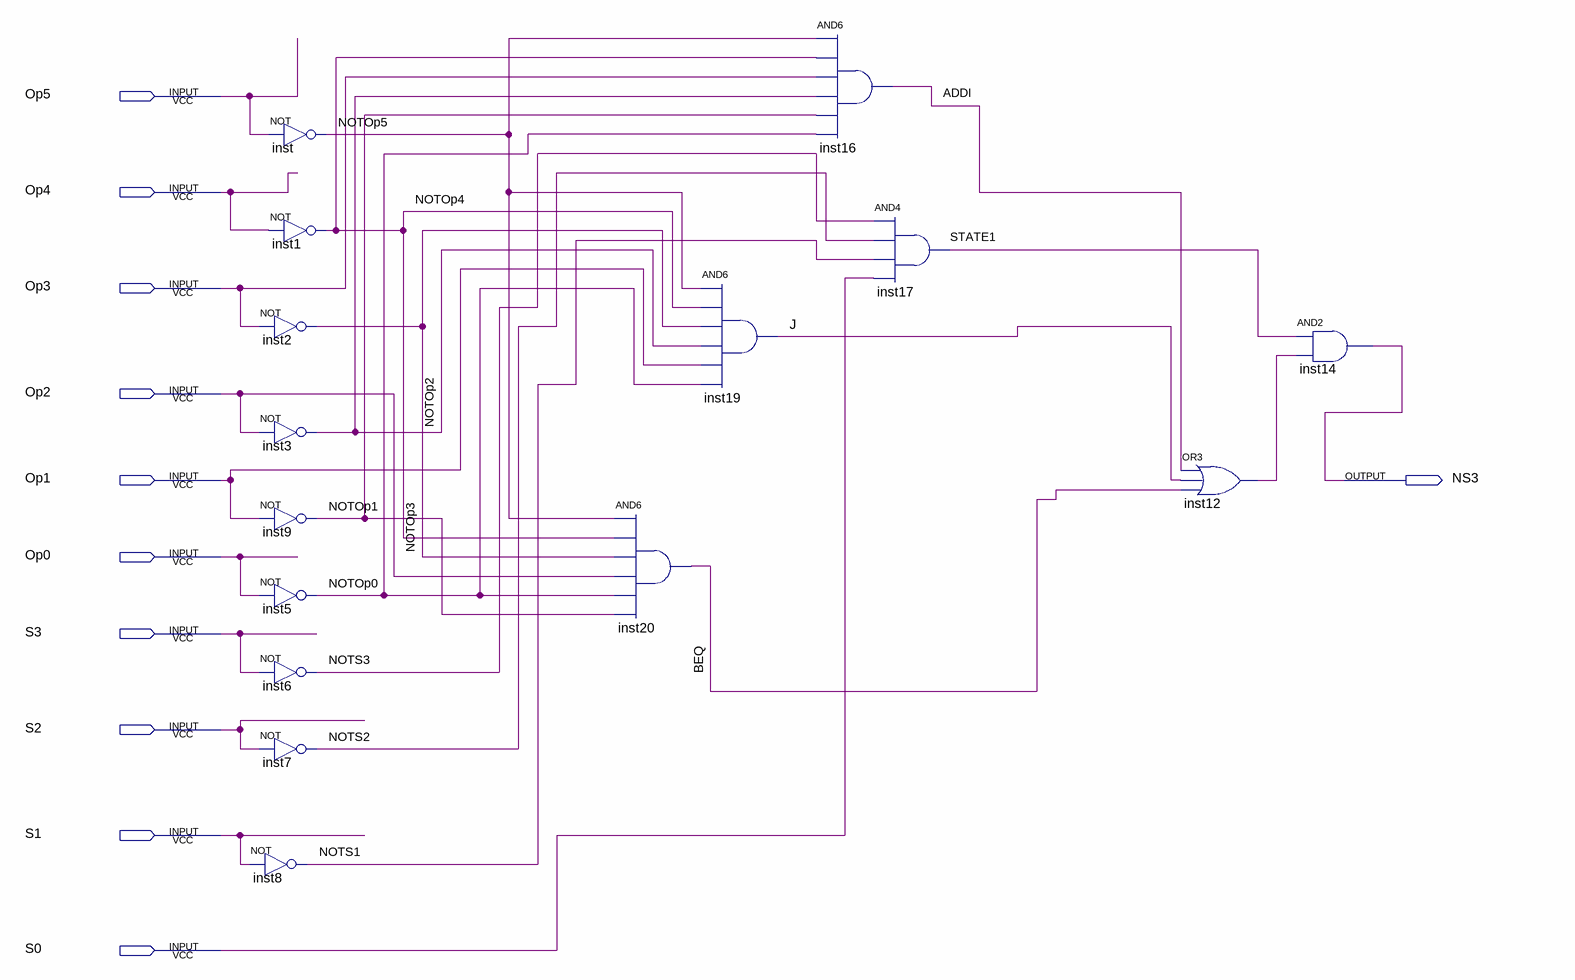
[diagram p0: schematic sheet]
// Quartus schematic NS3.bdf as structural Verilog: 15 symbols, 11 pins
module NS3 (
  input  Op5,
  input  Op4,
  input  Op3,
  input  Op2,
  input  Op1,
  input  Op0,
  input  S3,
  input  S2,
  input  S1,
  input  S0,
  output NS3
);

  wire ADDI, BEQ, inst12_out, J, NOTOp0, NOTOp1, NOTOp2, NOTOp3, NOTOp4, NOTOp5, NOTS1, NOTS2, NOTS3, STATE1;

  not inst (NOTOp5, Op5);
  not inst1 (NOTOp4, Op4);
  not inst2 (NOTOp3, Op3);
  not inst3 (NOTOp2, Op2);
  not inst9 (NOTOp1, Op1);
  not inst5 (NOTOp0, Op0);
  not inst6 (NOTS3, S3);
  not inst7 (NOTS2, S2);
  not inst8 (NOTS1, S1);
  and inst20 (BEQ, NOTOp5, NOTOp4, NOTOp3, Op2, NOTOp0, NOTOp1);
  and inst19 (J, NOTOp5, NOTOp4, NOTOp3, NOTOp2, Op1, NOTOp0);
  and inst16 (ADDI, NOTOp5, NOTOp4, Op3, NOTOp2, NOTOp1, NOTOp0);
  and inst17 (STATE1, NOTS3, NOTS2, NOTS1, S0);
  or inst12 (inst12_out, ADDI, J, BEQ);
  and inst14 (NS3, STATE1, inst12_out);
endmodule
